# Altium schematic sheet CHILD_BOARD.SchDoc
size A4; SheetNumber: 1; SheetTotal: 5
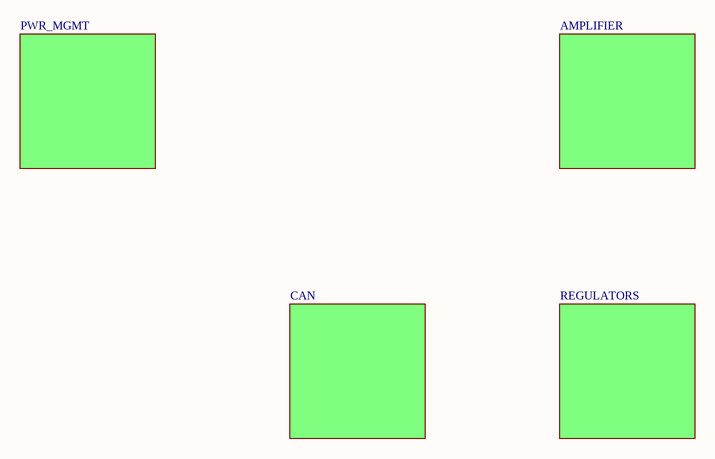
[diagram p0: CHILD_BOARD.SchDoc]

## Sub-sheets
AMPLIFIER = AMPLIFIER: no entries
CAN = CAN: no entries
PWR_MGMT = PWR_MGMT: no entries
REGULATORS = REGULATORS: no entries